# Altium schematic sheet 09_Connectors_STM32_B.SchDoc
size Letter; SheetNumber: 9; SheetTotal: 9
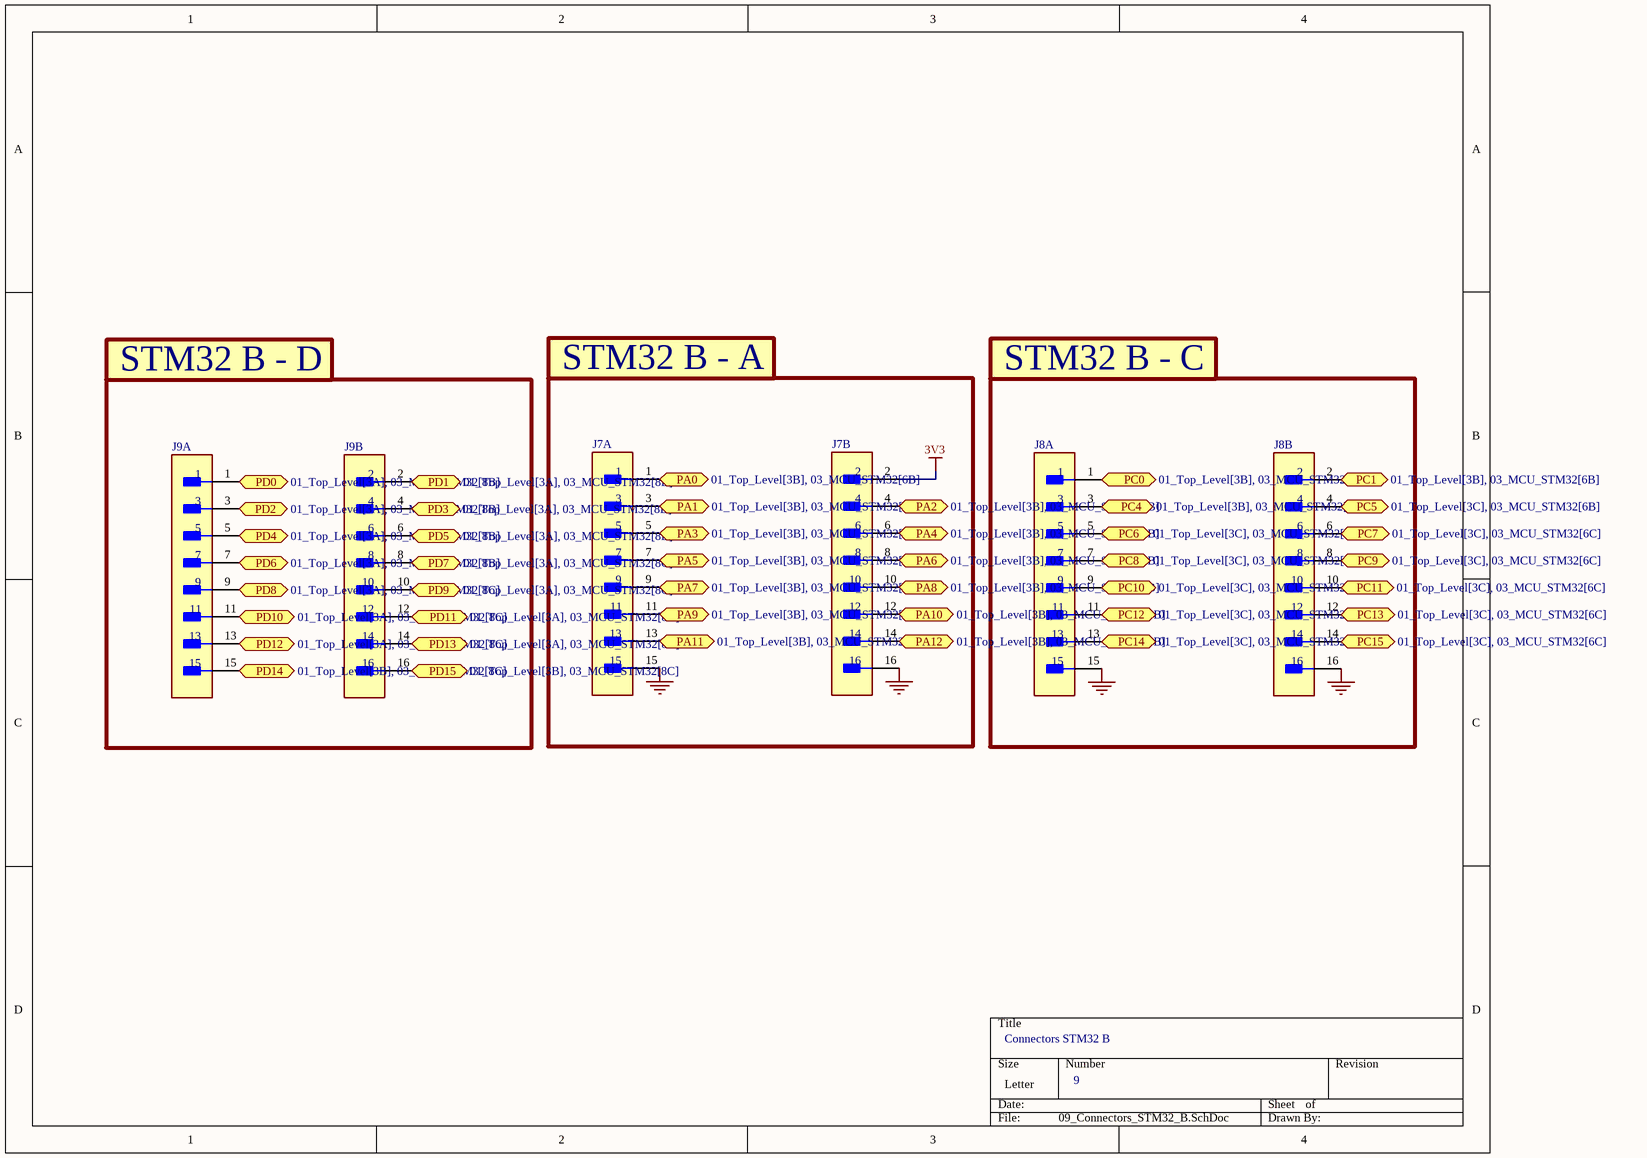
[diagram p0: 09_Connectors_STM32_B.SchDoc]

## Parts
J7  GRPB082MWCN-RC  [FP-GRPB082MWCN-RC-MFG]  (value not drawn)  (parts A,B of 2)
J8  GRPB082MWCN-RC  [FP-GRPB082MWCN-RC-MFG]  (value not drawn)  (parts A,B of 2)
J9  GRPB082MWCN-RC  [FP-GRPB082MWCN-RC-MFG]  (value not drawn)  (parts A,B of 2)

## Blocks framed on the sheet
STM32 B - D: J9
STM32 B - A: J7
STM32 B - C: J8

## Ports
PA0 (bidir, see 01_Top_Level[3B], 03_MCU_STM32[6B]), PA1 (bidir, see 01_Top_Level[3B], 03_MCU_STM32[6B]), PA2 (bidir, see 01_Top_Level[3B], 03_MCU_STM32[6B]), PA3 (bidir, see 01_Top_Level[3B], 03_MCU_STM32[6B]), PA4 (bidir, see 01_Top_Level[3B], 03_MCU_STM32[6B]), PA5 (bidir, see 01_Top_Level[3B], 03_MCU_STM32[6B]), PA6 (bidir, see 01_Top_Level[3B], 03_MCU_STM32[6B]), PA7 (bidir, see 01_Top_Level[3B], 03_MCU_STM32[6B]), PA8 (bidir, see 01_Top_Level[3B], 03_MCU_STM32[6B]), PA9 (bidir, see 01_Top_Level[3B], 03_MCU_STM32[6B]), PA10 (bidir, see 01_Top_Level[3B], 03_MCU_STM32[6B]), PA11 (bidir, see 01_Top_Level[3B], 03_MCU_STM32[6B]), PA12 (bidir, see 01_Top_Level[3B], 03_MCU_STM32[6B]), PC0 (bidir, see 01_Top_Level[3B], 03_MCU_STM32[6B]), PC1 (bidir, see 01_Top_Level[3B], 03_MCU_STM32[6B]), PC4 (bidir, see 01_Top_Level[3B], 03_MCU_STM32[6B]), PC5 (bidir, see 01_Top_Level[3C], 03_MCU_STM32[6B]), PC6 (bidir, see 01_Top_Level[3C], 03_MCU_STM32[6B]), PC7 (bidir, see 01_Top_Level[3C], 03_MCU_STM32[6C]), PC8 (bidir, see 01_Top_Level[3C], 03_MCU_STM32[6C]), PC9 (bidir, see 01_Top_Level[3C], 03_MCU_STM32[6C]), PC10 (bidir, see 01_Top_Level[3C], 03_MCU_STM32[6C]), PC11 (bidir, see 01_Top_Level[3C], 03_MCU_STM32[6C]), PC12 (bidir, see 01_Top_Level[3C], 03_MCU_STM32[6C]), PC13 (bidir, see 01_Top_Level[3C], 03_MCU_STM32[6C]), PC14 (bidir, see 01_Top_Level[3C], 03_MCU_STM32[6C]), PC15 (bidir, see 01_Top_Level[3C], 03_MCU_STM32[6C]), PD0 (bidir, see 01_Top_Level[3A], 03_MCU_STM32[8B]), PD1 (bidir, see 01_Top_Level[3A], 03_MCU_STM32[8B]), PD2 (bidir, see 01_Top_Level[3A], 03_MCU_STM32[8B]), PD3 (bidir, see 01_Top_Level[3A], 03_MCU_STM32[8B]), PD4 (bidir, see 01_Top_Level[3A], 03_MCU_STM32[8B]), PD5 (bidir, see 01_Top_Level[3A], 03_MCU_STM32[8B]), PD6 (bidir, see 01_Top_Level[3A], 03_MCU_STM32[8B]), PD7 (bidir, see 01_Top_Level[3A], 03_MCU_STM32[8C]), PD8 (bidir, see 01_Top_Level[3A], 03_MCU_STM32[8C]), PD9 (bidir, see 01_Top_Level[3A], 03_MCU_STM32[8C]), PD10 (bidir, see 01_Top_Level[3A], 03_MCU_STM32[8C]), PD11 (bidir, see 01_Top_Level[3A], 03_MCU_STM32[8C]), PD12 (bidir, see 01_Top_Level[3A], 03_MCU_STM32[8C]), PD13 (bidir, see 01_Top_Level[3A], 03_MCU_STM32[8C]), PD14 (bidir, see 01_Top_Level[3B], 03_MCU_STM32[8C]), PD15 (bidir, see 01_Top_Level[3B], 03_MCU_STM32[8C])

## Nets
3V3: J7.2
GND: J7.15 J7.16 J8.15 J8.16
PA0: J7.1 ; port PA0
PA1: J7.3 ; port PA1
PA2: J7.4 ; port PA2
PA3: J7.5 ; port PA3
PA4: J7.6 ; port PA4
PA5: J7.7 ; port PA5
PA6: J7.8 ; port PA6
PA7: J7.9 ; port PA7
PA8: J7.10 ; port PA8
PA9: J7.11 ; port PA9
PA10: J7.12 ; port PA10
PA11: J7.13 ; port PA11
PA12: J7.14 ; port PA12
PC0: J8.1 ; port PC0
PC1: J8.2 ; port PC1
PC4: J8.3 ; port PC4
PC5: J8.4 ; port PC5
PC6: J8.5 ; port PC6
PC7: J8.6 ; port PC7
PC8: J8.7 ; port PC8
PC9: J8.8 ; port PC9
PC10: J8.9 ; port PC10
PC11: J8.10 ; port PC11
PC12: J8.11 ; port PC12
PC13: J8.12 ; port PC13
PC14: J8.13 ; port PC14
PC15: J8.14 ; port PC15
PD0: J9.1 ; port PD0
PD1: J9.2 ; port PD1
PD2: J9.3 ; port PD2
PD3: J9.4 ; port PD3
PD4: J9.5 ; port PD4
PD5: J9.6 ; port PD5
PD6: J9.7 ; port PD6
PD7: J9.8 ; port PD7
PD8: J9.9 ; port PD8
PD9: J9.10 ; port PD9
PD10: J9.11 ; port PD10
PD11: J9.12 ; port PD11
PD12: J9.13 ; port PD12
PD13: J9.14 ; port PD13
PD14: J9.15 ; port PD14
PD15: J9.16 ; port PD15

## Notes on the sheet
- Connectors STM32 B
- 9

## Library data of the parts
J7-J9 = CMP-25680-000081-1: CONN HEADER R/A 16POS 1.27MM; Number of Positions: 16; Row Spacing: 0.05inch; Max Operating Temperature: 105°C; Flammability Rating: UL94 V-0; Contact Type: Male Pin; Termination: Solder; Contact Material: Brass; Package Quantity: 1; Lead Free: Lead Free; Min Operating Temperature: -40°C; Contact Shape: Square; Insulation Material: Nylon; Contact Plating: Gold; Connector Type: Header; Mount: Through Hole; Pitch: 1.27mm; RoHS Compliant: Yes; Fastening Type: Pull; Number of Rows: 2; Contact Mating Length: 0.118inch; Series: -; Packaging: Bulk; Contact Finish - Mating: GOLD